# Altium schematic sheet USBSwitch.SchDoc
size A3
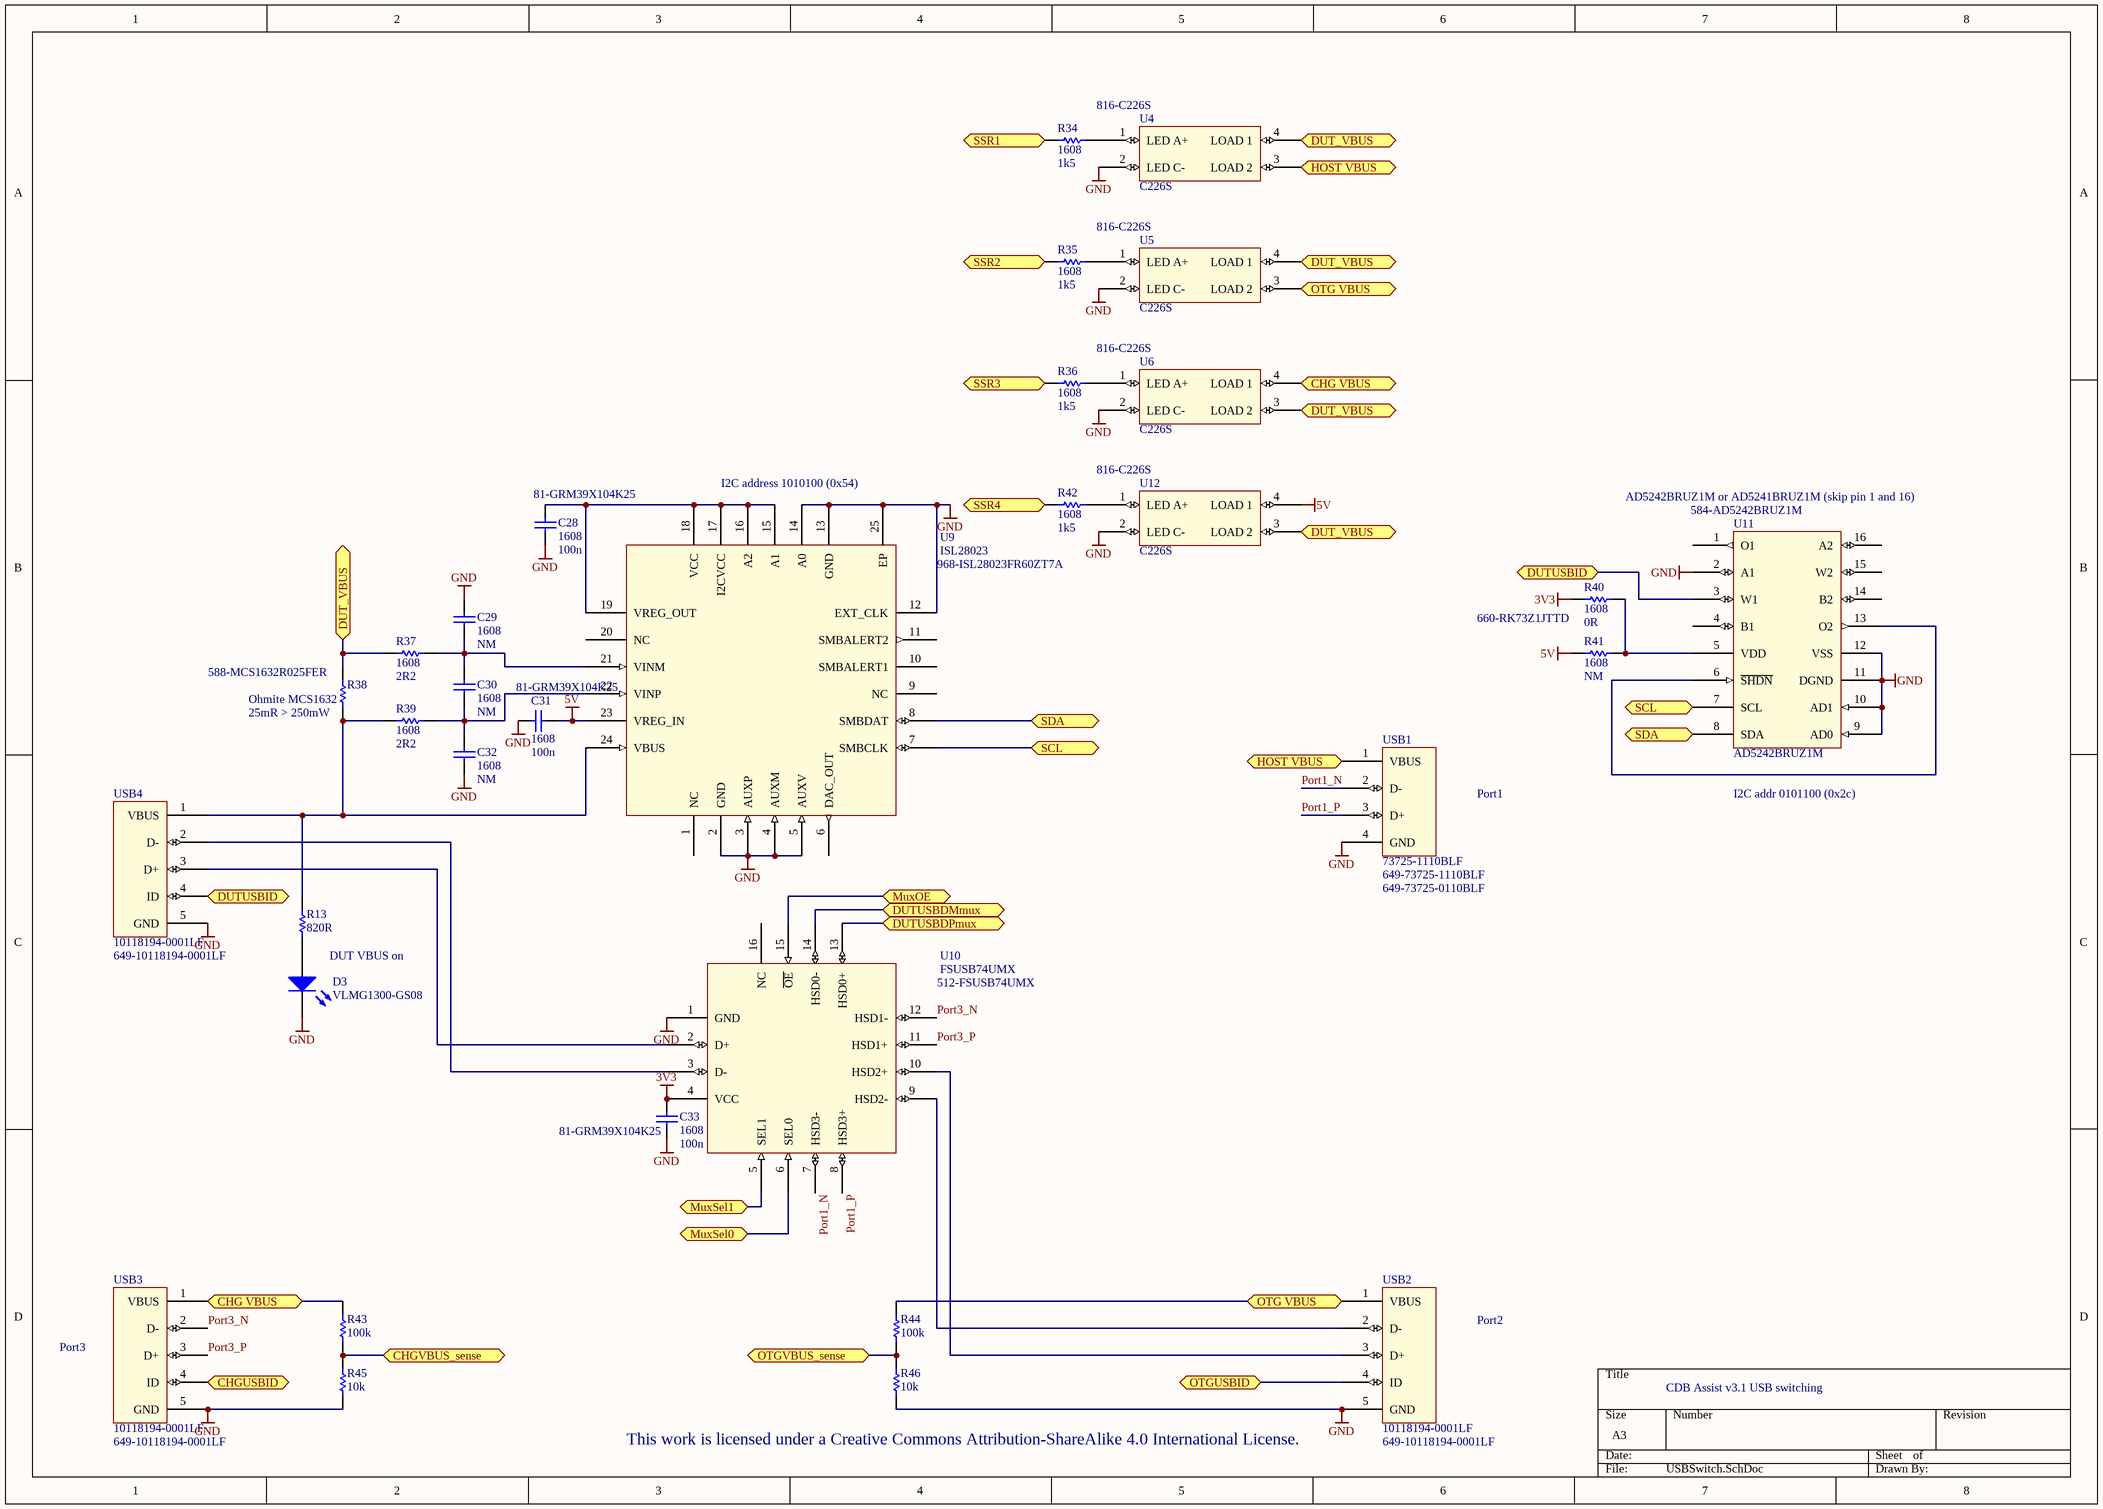
[diagram p0: USBSwitch.SchDoc]

## Parts
C28  1608  value 100n  Supplier Part Number 1: 81-GRM39X104K25  [RESC1608N]
C29  1608  value NM  [RESC1608N]
C30  1608  value NM  [RESC1608N]
C31  1608  value 100n  Supplier Part Number 1: 81-GRM39X104K25  [RESC1608N]
C32  1608  value NM  [RESC1608N]
C33  1608  value 100n  Supplier Part Number 1: 81-GRM39X104K25  [RESC1608N]
D3  VLMG1300-GS08  [CAPC1608N]
R13  value 820R  [RESC1608N]  (hidden comment: 1608)
R34  1608  value 1k5  [RESC1608N]
R35  1608  value 1k5  [RESC1608N]
R36  1608  value 1k5  [RESC1608N]
R37  1608  value 2R2  [RESC1608N]
R38  Ohmite MCS1632  value 25mR > 250mW  Supplier Part Number 1: 588-MCS1632R025FER  [RESC3216X06N]
R39  1608  value 2R2  [RESC1608N]
R40  1608  value 0R  Supplier Part Number 1: 660-RK73Z1JTTD  [RESC1608N]
R41  1608  value NM  [RESC1608N]
R42  1608  value 1k5  [RESC1608N]
R43  value 100k  [RESC1608N]  (hidden comment: 1608)
R44  value 100k  [RESC1608N]  (hidden comment: 1608)
R45  value 10k  [RESC1608N]  (hidden comment: 1608)
R46  value 10k  [RESC1608N]  (hidden comment: 1608)
U4  C226S  Supplier Part Number 1: 816-C226S  [COTO C226S SOP]
U5  C226S  Supplier Part Number 1: 816-C226S  [COTO C226S SOP]
U6  C226S  Supplier Part Number 1: 816-C226S  [COTO C226S SOP]
U9  ISL28023  Supplier Part Number 1: 968-ISL28023FR60ZT7A  [ISL28023]
U10  FSUSB74UMX  Supplier Part Number 1: 512-FSUSB74UMX  [16-pin 2.6x1.8mm UMLP]
U11  AD5242BRUZ1M  Supplier Part Number 1: 584-AD5242BRUZ1M  [AD5242 TSSOP]
U12  C226S  Supplier Part Number 1: 816-C226S  [COTO C226S SOP]
USB1  73725-1110BLF  Supplier Part Number 1: 649-73725-0110BLF  Supplier Part Number 2: 649-73725-1110BLF  [AUSB]
USB2  10118194-0001LF  Supplier Part Number 1: 649-10118194-0001LF  [uUSB]
USB3  10118194-0001LF  Supplier Part Number 1: 649-10118194-0001LF  [uUSB]
USB4  10118194-0001LF  Supplier Part Number 1: 649-10118194-0001LF  [uUSB]

## Ports
CHG VBUS, CHGUSBID, CHGVBUS_sense, DUT_VBUS, DUTUSBDMmux, DUTUSBDPmux, DUTUSBID, HOST VBUS, MuxOE, MuxSel0, MuxSel1, OTG VBUS, OTGUSBID, OTGVBUS_sense, SCL, SDA, SSR1, SSR2, SSR3, SSR4

## Nets
3V3: C33.2 R40.2 U10.4(VCC)
5V: C31.2 R41.2 U9.23(VREG_IN) U12.4(LOAD_1)
GND: C28.1 C29.1 C31.1 C32.2 C33.1 D3.2(K) R45.1 R46.1 U4.2(LED_C-) U5.2(LED_C-) U6.2(LED_C-) U9.2(GND) U9.3(AUXP) U9.4(AUXM) U9.5(AUXV) U9.12(EXT_CLK) U9.13(GND) U9.14(A0) U9.25(EP) U10.1(GND) U11.2(A1) U11.9(AD0) U11.10(AD1) U11.11(DGND) U11.12(VSS) U12.2(LED_C-) USB1.4(GND) USB2.5(GND) USB3.5(GND) USB4.5(GND)
CHG VBUS: R43.2 U6.4(LOAD_1) USB3.1(VBUS) ; port CHG VBUS
CHGUSBID: USB3.4(ID) ; port CHGUSBID
CHGVBUS_sense: R43.1 R45.2 ; port CHGVBUS_sense
DUT_VBUS: R37.2 R38.1 U4.4(LOAD_1) U5.4(LOAD_1) U6.3(LOAD_2) U12.3(LOAD_2) ; port DUT_VBUS
DUTUSBDMmux: U10.14(HSD0-) ; port DUTUSBDMmux
DUTUSBDPmux: U10.13(HSD0+) ; port DUTUSBDPmux
DUTUSBID: U11.3(W1) USB4.4(ID) ; port DUTUSBID
HOST VBUS: U4.3(LOAD_2) USB1.1(VBUS) ; port HOST VBUS
MuxOE: U10.15(~{OE}) ; port MuxOE
MuxSel0: U10.6(SEL0) ; port MuxSel0
MuxSel1: U10.5(SEL1) ; port MuxSel1
OTG VBUS: R44.2 U5.3(LOAD_2) USB2.1(VBUS) ; port OTG VBUS
OTGUSBID: USB2.4(ID) ; port OTGUSBID
OTGVBUS_sense: R44.1 R46.2 ; port OTGVBUS_sense
Port1_N: U10.7(HSD3-) USB1.2(D-)
Port1_P: U10.8(HSD3+) USB1.3(D+)
Port3_N: U10.12(HSD1-) USB3.2(D-)
Port3_P: U10.11(HSD1+) USB3.3(D+)
SCL: U9.7(SMBCLK) U11.7(SCL) ; port SCL
SDA: U9.8(SMBDAT) U11.8(SDA) ; port SDA
SSR1: R34.2 ; port SSR1
SSR2: R35.2 ; port SSR2
SSR3: R36.2 ; port SSR3
SSR4: R42.2 ; port SSR4
NetC28_2: C28.2 U9.15(A1) U9.16(A2) U9.17(I2CVCC) U9.18(VCC) U9.19(VREG_OUT)
NetC29_2: C29.2 C30.1 R37.1 U9.21(VINM)
NetC30_2: C30.2 C32.1 R39.1 U9.22(VINP)
NetD3_1: D3.1(A) R13.1
NetR13_2: R13.2 R38.2 R39.2 U9.24(VBUS) USB4.1(VBUS)
NetR34_1: R34.1 U4.1(LED_A+)
NetR35_1: R35.1 U5.1(LED_A+)
NetR36_1: R36.1 U6.1(LED_A+)
NetR40_1: R40.1 R41.1 U11.5(VDD)
NetR42_1: R42.1 U12.1(LED_A+)
NetU10_2: U10.2(D+) USB4.3(D+)
NetU10_3: U10.3(D-) USB4.2(D-)
NetU10_9: U10.9(HSD2-) USB2.2(D-)
NetU10_10: U10.10(HSD2+) USB2.3(D+)
NetU11_6: U11.6(~{SHDN}) U11.13(O2)

Not connected (* = marked no-connect by the designer): U9 1(NC) 6(DAC_OUT) 9(NC) 10(SMBALERT1) 11(SMBALERT2) 20(NC); U10 16(NC); U11 1(O1) 4(B1) 14(B2) 15(W2) 16(A2)

## Notes on the sheet
- I2C address 1010100 (0x54)
- (near U11) AD5242BRUZ1M or AD5241BRUZ1M (skip pin 1 and 16)
- Port1
- I2C addr 0101100 (0x2c)
- DUT VBUS on
- Port2
- Port3
- CDB Assist v3.1 USB switching
- This work is licensed under a Creative Commons Attribution-ShareAlike 4.0 International License.

## Library data of the parts
C28 C31 C33 = Cap Semi: Capacitor (Semiconductor SIM Model); Manufacturer: Murata Electronics; Manufacturer Part Number: GRM188R71E104KA01D; Capacitance: 0.1 uF; Tolerance: 10 %; Type: General Purpose MLCC; Voltage Rating DC: 25 V; Case Height: 0.8 mm; Case Length: 1.6 mm; Dielectric: X7R; Temperature Coefficient / Code: +/- 15 %; Published: 8-Jun-2000; LatestRevisionDate: 29-May-2009; LatestRevisionNote: IPC-7351 Footprint Added.; PackageReference: C1206; Publisher: Altium Limited; PackageDescription: Chip Capacitor; Supplier 1: Mouser; RoHS: RoHS Compliant; Category: Multilayer Ceramic Capacitors MLCC - SMD/SMT; Stock 1: 1414567; Pricing 1: 1=0.100, 10=0.011, 100=0.007, 1000=0.005, 4000=0.004, 48000=0.003 (USD); Operating Temperature Range: - 55 C to + 125 C; Package / Case: 0603 (1608 metric); Packaging: Reel; Product: General Type MLCCs; Series: GRM; Termination Style: SMD/SMT; Brand: Murata Electronics; Case Code - in: 0603; Case Code - mm: 1608; Case Width: 0.8 mm; Maximum Operating Temperature: + 125 C; Minimum Operating Temperature: - 55 C; Product Category: Low & Medium Capacitance SMD Ceramic Chip Capacitors; Standard Pack Qty: 4000; RoHS - Mouser: Y; Minimum Order Quantity: 1; Reeling: True; ComponentLink1URL: http://www.murata.com/products/catalog/pdf/c02e.pdf; ComponentLink1Description: http://www.murata.com/products/catalog/pdf/c02e.pdf
C29 C30 C32 = Cap Semi: Capacitor (Semiconductor SIM Model); Published: 8-Jun-2000; LatestRevisionDate: 29-May-2009; LatestRevisionNote: IPC-7351 Footprint Added.; PackageReference: C1206; Publisher: Altium Limited; PackageDescription: Chip Capacitor
D3 = LED2: Typical RED, GREEN, YELLOW, AMBER GaAs LED; pin to pad: 1>2 2>1; Published: 8-Jun-2000; LatestRevisionDate: 17-Jul-2002; LatestRevisionNote: Re-released for DXP Platform.; PackageVersion: Feb-2002; PackageReference: 3.2X1.6X1.1; Publisher: Altium Limited; PackageDescription: SM LED; 2 Flat Leads; PN_DigiKey: VLMG1300-GS08CT-ND
R13 R43-R46 = Res1: Resistor; Published: 8-Jun-2000; LatestRevisionDate: 17-Jul-2002; LatestRevisionNote: Re-released for DXP Platform.; PackageReference: AXIAL-0.3; Publisher: Altium Limited; PackageDescription: Axial Device, Thru-Hole; 2 Leads; 0.3 in Pin Spacing
R34-R37 R39 R41 R42 = Res Semi: Semiconductor Resistor; Published: 8-Jun-2000; LatestRevisionDate: 17-Jul-2002; LatestRevisionNote: Re-released for DXP Platform.; PackageReference: AXIAL-0.5; Publisher: Altium Limited; PackageDescription: Axial Device, Thru-Hole; 2 Leads; 0.5 in Pin Spacing
R38 = Res Semi: Semiconductor Resistor; Manufacturer Part Number: MCS1632R025FER; Power Rating: 1 W; Resistance: 0.025 Ohms; Temperature Coefficient: 50 PPM / C; Tolerance: 1 %; Voltage Rating: 220 mV; Case Height: 0.6 mm; Case Length: 3.2 mm; Case Width: 1.6 mm; Published: 8-Jun-2000; LatestRevisionDate: 17-Jul-2002; LatestRevisionNote: Re-released for DXP Platform.; PackageReference: AXIAL-0.5; Publisher: Altium Limited; PackageDescription: Axial Device, Thru-Hole; 2 Leads; 0.5 in Pin Spacing; Supplier 1: Mouser; Manufacturer: Ohmite; RoHS: RoHS Compliant; Category: Current Sense Resistors - SMD; Stock 1: 6607; Pricing 1: 1=0.570, 10=0.474, 25=0.366, 100=0.319, 250=0.285, 500=0.231, 1000=0.187, 5000=0.168 (USD); Operating Temperature Range: - 25 C to + 125 C; Package / Case: 0612 (1632 metric) Reversed; Packaging: Reel; Product: Metal Element Current Sensing Resistors; Series: MCS; Termination Style: SMD/SMT; Brand: Ohmite; Case Code - in: 0612 (Reversed); Case Code - mm: 1632 (Reversed); Product Category: Current Sense Resistors; Standard Pack Qty: 5000; RoHS - Mouser: Y; Minimum Order Quantity: 1; Reeling: True; ComponentLink1URL: http://www.mouser.com/ds/2/303/mcs-14321.pdf; ComponentLink1Description: http://www.mouser.com/ds/2/303/mcs-14321.pdf
R40 = Res Semi: Semiconductor Resistor; Manufacturer: KOA Speer; Manufacturer Part Number: RK73Z1JTTD; Resistance: 0 Ohms; Case Height: 0.45 mm; Case Length: 1.6 mm; Case Width: 0.8 mm; Published: 8-Jun-2000; LatestRevisionDate: 17-Jul-2002; LatestRevisionNote: Re-released for DXP Platform.; PackageReference: AXIAL-0.5; Publisher: Altium Limited; PackageDescription: Axial Device, Thru-Hole; 2 Leads; 0.5 in Pin Spacing; Supplier 1: Mouser; RoHS: RoHS Compliant By Exemption; Category: Thick Film Resistors - SMD; Stock 1: 2013988; Pricing 1: 1=0.100, 10=0.009, 100=0.004, 1000=0.003, 5000=0.002 (USD); Operating Temperature Range: - 55 C to + 155 C; Package / Case: 0603 (1608 metric); Packaging: Reel; Power Rating: -; Product: Thick Film Resistors Zero-Ohm; Series: RK73Z; Temperature Coefficient: -; Tolerance: -; Voltage Rating: -; Brand: KOA Speer; Case Code - in: 0603; Case Code - mm: 1608; Product Category: 0603 SMD Thick Film Chip Resistors; Standard Pack Qty: 5000; RoHS - Mouser: E; Minimum Order Quantity: 1; Reeling: True; ComponentLink1URL: http://www.mouser.com/ds/2/219/RK73Z-11765.pdf; ComponentLink1Description: http://www.mouser.com/ds/2/219/RK73Z-11765.pdf
U4-U6 U12 = C226S: Manufacturer: Coto Technology; Contact Form: SPST (1 Form A); Control Voltage Range: 5 V to 40 V; Output Device: MOSFET; Load Current Rating: 2 A; Load Voltage Rating: 40 V; On Resistance - Max: 0.5 Ohms; Product Status: New Product; PN_DigiKey: 306-1358-ND; Supplier 1: Mouser; Manufacturer Part Number: C226S; Category: Solid State Relays - PCB Mount; Stock 1: 298; Pricing 1: 1=3.90, 10=3.66, 25=3.25, 100=2.92, 250=2.60, 500=2.44, 1000=2.28, 2500=2.23, 5000=2.19 (USD); Package / Case: SOP-4; Product: Data Acquisition Relays; Termination Style: Gull Wing Lead; Brand: Coto Technology; Mounting Style: SMD/SMT; Maximum Operating Temperature: + 85 C; Minimum Operating Temperature: - 40 C; Standard Pack Qty: 100; Tradename: CotoMOS; Minimum Order Quantity: 1; Reeling: False; ComponentLink1URL: http://www.mouser.com/ds/2/89/cs_ct series-252846.pdf; ComponentLink1Description: http://www.mouser.com/ds/2/89/cs_ct series-252846.pdf
U9 = ISL28023: Manufacturer: Intersil; Manufacturer Part Number: ISL28023FR60Z-T7A; Accuracy: 0.05 %; Output Current: 1 mA; Sensing Method: High or Low Side; Supply Current: 1.2 mA; Input Voltage Range: 0 V to 60 V; Development Kit: ISL28023EVKIT1Z; Supply Voltage - Max: 5.5 V; Supply Voltage - Min: 3 V; Product Status: New at Mouser; Supplier 1: Mouser; RoHS: RoHS Compliant; Category: Current & Power Monitors & Regulators; Stock 1: 489; Pricing 1: 1=4.98, 25=4.05, 100=3.44, 250=2.83, 500=2.31 (USD); Operating Temperature Range: - 40 C to + 125 C; Package / Case: QFN-24; Packaging: Tube; Product: Power Monitors; Series: ISL28023; Brand: Intersil; Mounting Style: SMD/SMT; RoHS - Mouser: Y; Minimum Order Quantity: 1; Reeling: False; ComponentLink1URL: http://www.mouser.com/ds/2/465/isl28023-364245.pdf; ComponentLink1Description: http://www.mouser.com/ds/2/465/isl28023-364245.pdf
U10 = FSUSB74: Manufacturer: Fairchild Semiconductor; Supply Current: 9 uA; Supply Voltage - Max: 4.4 V; Supply Voltage - Min: 2.7 V; PN_DigiKey: FSUSB74UMXCT-ND; Supplier 1: Mouser; Manufacturer Part Number: FSUSB74UMX; RoHS: RoHS Compliant; Category: USB Switch ICs; Stock 1: 4080; Pricing 1: 1=1.57, 10=1.21, 100=0.967, 500=0.882, 1000=0.674, 5000=0.598, 10000=0.575 (USD); Package / Case: UMLP-16; Packaging: Reel; Series: FSUSB74; Brand: Fairchild Semiconductor; Maximum Operating Temperature: + 85 C; Minimum Operating Temperature: - 40 C; Standard Pack Qty: 5000; RoHS - Mouser: Y; Minimum Order Quantity: 1; Reeling: True; ComponentLink1URL: http://www.mouser.com/ds/2/149/FSUSB74-83766.pdf; ComponentLink1Description: http://www.mouser.com/ds/2/149/FSUSB74-83766.pdf
U11 = AD5242BRUZ: Manufacturer: Analog Devices; Buffered Wiper: Buffered; Digital Interface: I2C; Resistance: 1 MOhms; Supply Current: 100 nA; Temperature Coefficient: 30 PPM / C; Tolerance: 30 %; Number of POTs: Dual; Taps per POT: 256; Wiper Memory: Volatile; Development Kit: EVAL-AD5242EBZ; Operating Supply Voltage: 5.5 V; Supply Voltage - Min: 2.7 V; Product Status: New at Mouser; PN_DigiKey: AD5242BRUZ1M-ND; Supplier 1: Mouser; Manufacturer Part Number: AD5242BRUZ1M; RoHS: RoHS Compliant; Category: Digital Potentiometer ICs; Stock 1: 378; Pricing 1: 1=3.20, 10=2.86, 25=2.57, 50=2.41, 100=2.34, 250=2.11, 500=1.90, 1000=1.60, 2500=1.52 (USD); Package / Case: TSSOP-16; Packaging: Tube; Series: AD5242; Brand: Analog Devices; Mounting Style: SMD/SMT; Maximum Operating Temperature: + 105 C; Minimum Operating Temperature: - 40 C; Standard Pack Qty: 96; Supply Voltage - Max: 5.5 V; RoHS - Mouser: Y; Minimum Order Quantity: 1; Reeling: False; ComponentLink1URL: http://www.mouser.com/ds/2/609/AD5241_5242-246487.pdf; ComponentLink1Description: http://www.mouser.com/ds/2/609/AD5241_5242-246487.pdf
USB1 = AUSB: Manufacturer: FCI; Manufacturer Part Number: 73725-0110BLF; Connector Type: USB Type A Receptacle, Upright; Gender: Female; Mounting Angle: Right; Number of Contacts: 4; Number of Ports: 1; PN_DigiKey: 73725-1110BLF-ND; Supplier 1: Mouser; RoHS: RoHS Compliant; Category: USB Connectors; Stock 1: 6682; Pricing 1: 1=0.850, 10=0.704, 100=0.645, 250=0.587, 500=0.528, 1000=0.469, 2500=0.425, 5000=0.410, 10000=0.381 (USD); Color: White; Contact Plating: Palladium Nickel Alloy (GXT); Features: Single stack, no back shield, without sensor contact; Packaging: Tube; Product: USB Type A Connectors; Termination Style: Solder Pin; Brand: FCI; Contact Material: Copper Alloy; Flammability Rating: UL 94 V-0; Shell Plating: Tin; Product Category: USB Connectors; Standard: USB 2.0; Standard Pack Qty: 30; RoHS - Mouser: Y; Minimum Order Quantity: 1; Reeling: False; ComponentLink1URL: http://www.mouser.com/ds/2/154/gs-12-095-532824.pdf; ComponentLink1Description: http://www.mouser.com/ds/2/154/gs-12-095-532824.pdf; Supplier 2: Mouser; Stock 2: 0; Pricing 2: 1=0.870, 10=0.745, 100=0.680, 250=0.615, 500=0.551, 1000=0.470, 2500=0.469, 5000=0.453, 10000=0.421 (USD)
USB2-USB4 = uUSB: Manufacturer: FCI; Connector Type: Micro USB Type B receptacle; Current Rating: 1.8 A; Gender: Female; Mounting Angle: Right; Number of Contacts: 5; Insulation Resistance: 1000 MOhms; PN_DigiKey: 609-4618-1-ND; Supplier 1: Mouser; Manufacturer Part Number: 10118194-0001LF; RoHS: RoHS Compliant; Category: USB Connectors; Stock 1: 43615; Pricing 1: 1=0.460, 10=0.316, 100=0.273, 500=0.260, 1200=0.197, 2400=0.180, 4800=0.158, 9600=0.152, 24000=0.147 (USD); Color: Black; Contact Plating: Gold; Operating Temperature Range: - 55 C to + 85 C; Packaging: Reel; Product: Micro USB Type B Connectors; Termination Style: SMD; Brand: FCI; Contact Material: Copper Alloy; Flammability Rating: UL 94 V-0; Standard: USB 2.0; Standard Pack Qty: 1200; RoHS - Mouser: Y; Minimum Order Quantity: 1; Reeling: True; ComponentLink1URL: http://www.mouser.com/ds/2/154/10118194AC-197217.pdf; ComponentLink1Description: http://www.mouser.com/ds/2/154/10118194AC-197217.pdf